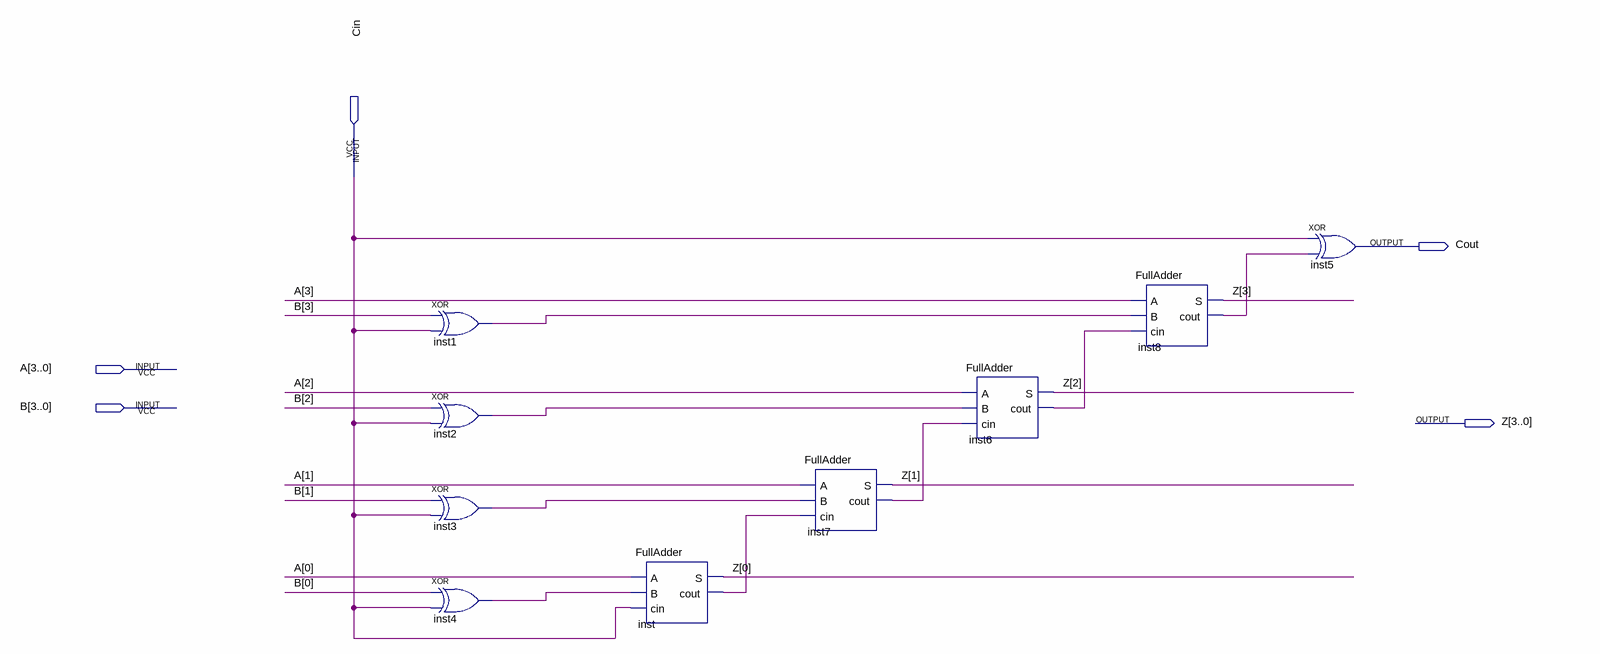
[diagram p0: schematic sheet]
// Quartus schematic adder.bdf as structural Verilog: 9 symbols, 5 pins
module adder (
  input  Cin,
  input  [3:0] A,
  input  [3:0] B,
  output Cout,
  output [3:0] Z
);

  wire inst1_out, inst2_out, inst3_out, inst4_out, inst6_cout, inst7_cout, inst8_cout, inst_cout;

  xor inst1 (inst1_out, B[3], Cin);
  xor inst2 (inst2_out, B[2], Cin);
  xor inst3 (inst3_out, B[1], Cin);
  xor inst4 (inst4_out, B[0], Cin);
  FullAdder inst (.A(A[0]), .B(inst4_out), .cin(Cin), .S(Z[0]), .cout(inst_cout));
  FullAdder inst7 (.A(A[1]), .B(inst3_out), .cin(inst_cout), .S(Z[1]), .cout(inst7_cout));
  FullAdder inst6 (.A(A[2]), .B(inst2_out), .cin(inst7_cout), .S(Z[2]), .cout(inst6_cout));
  FullAdder inst8 (.A(A[3]), .B(inst1_out), .cin(inst6_cout), .S(Z[3]), .cout(inst8_cout));
  xor inst5 (Cout, Cin, inst8_cout);
endmodule
